# EAGLE schematic dengenver4.0 (EAGLE 9.6.2)
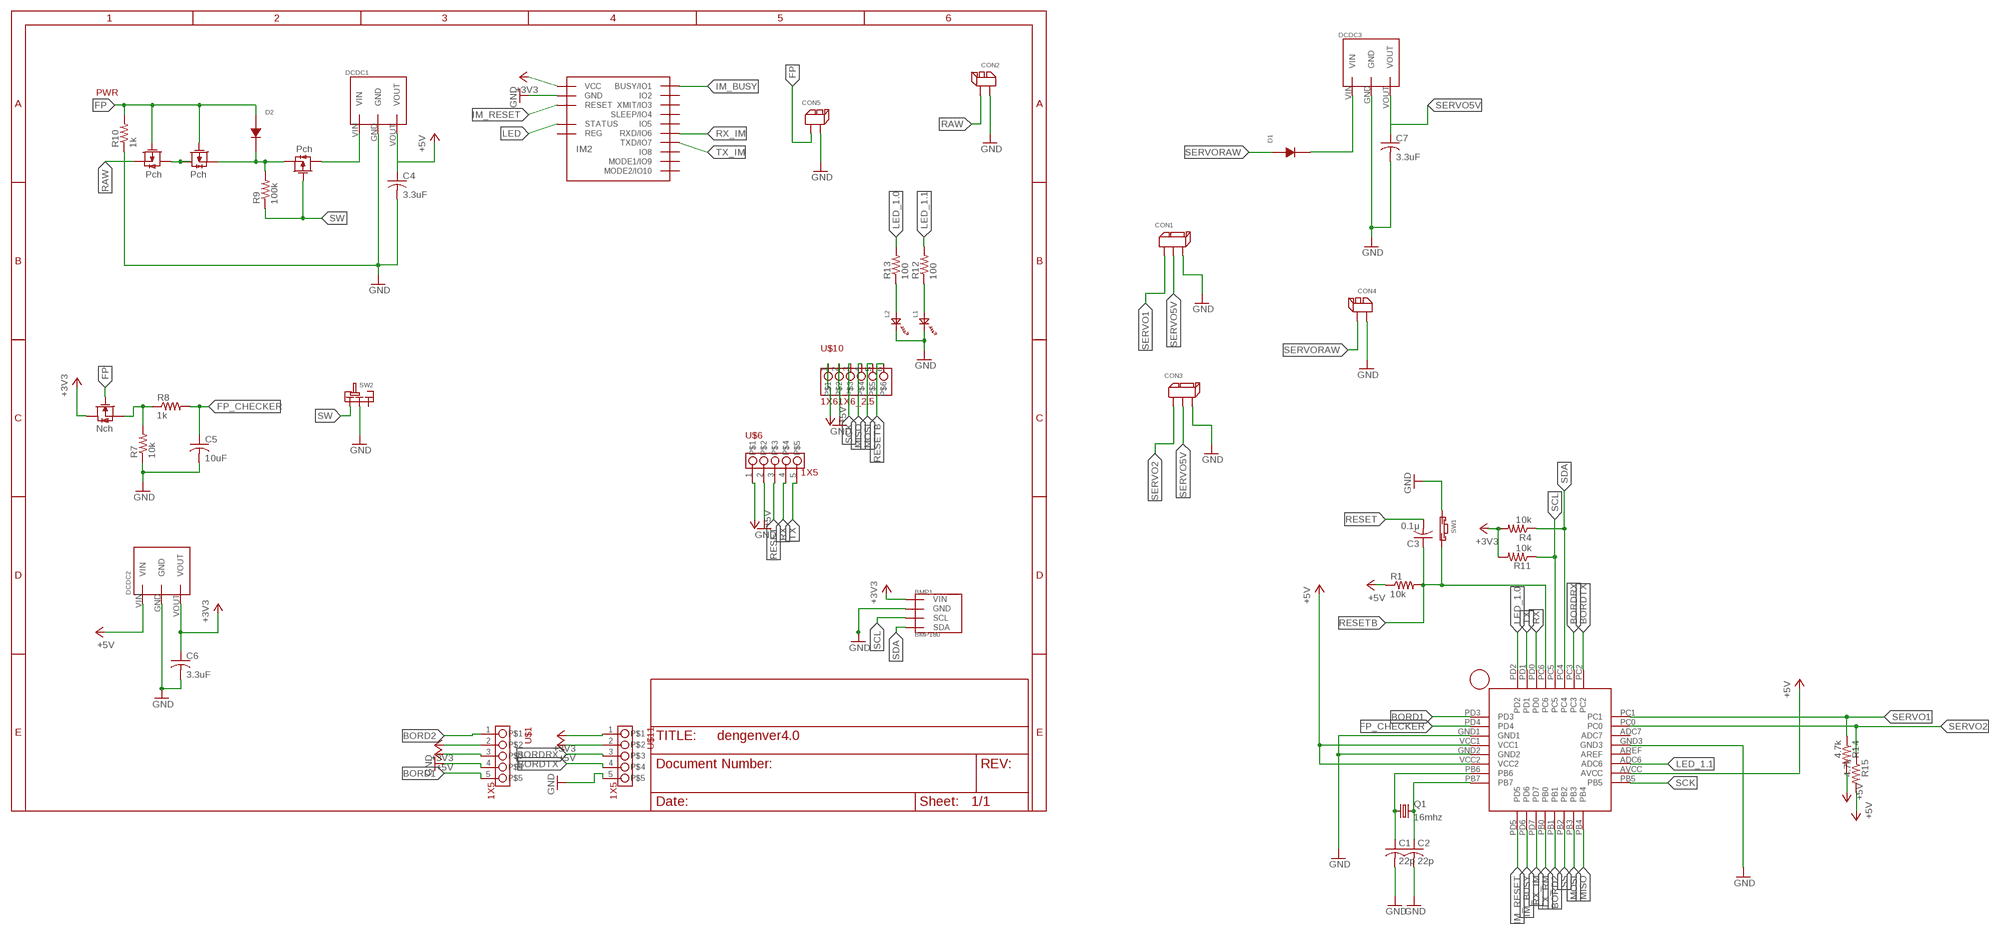
[diagram p0: schematic, sheet 1]

## Parts
BMP1  BMP180  [GY-68]
C1  22p  C-USC1608  [C1608]
C2  22p  C-USC1608  [C1608]
C3  0.1μ  C-USC1608  [C1608]
C4  3.3uF  C-USC1608  [C1608]
C5  10uF  C-USC1608  [C1608]
C6  3.3uF  C-USC1608  [C1608]
C7  3.3uF  C-USC0603  [C0603]
CON1  3PIN  [3PIN]
CON2  2PIN  [2PIN]
CON3  3PIN  [3PIN]
CON4  2PIN  [2PIN]
CON5  2PIN  [2PIN]
D1  1W4148W  [SOD-123]
D2  1W4148W  [SOD-123]
DCDC1  5V1A_M78AR05-1  [5V1A_M78AR05-1]
DCDC2  3.3V1A_M78AR033-1  [3.3V1A_M78AR033-1]
DCDC3  5V1A_M78AR05-1  [5V1A_M78AR05-1]
IM2  IM920_IM920C  [IM920_IM920C]
L1  OSXX1608C1A  [OSXX1608C1A]
L2  OSXX1608C1A  [OSXX1608C1A]
Q1  16mhz  CRYSTALHC49UP  [HC49UP]
R1  10k  R-US_R0603  [R0603]
R4  10k  R-US_R0603  [R0603]
R7  10k  R-US_R0603  [R0603]
R8  1k  R-US_R0603  [R0603]
R9  100k  R-US_R0603  [R0603]
R10  1k  R-US_R0603  [R0603]
R11  10k  R-US_R0603  [R0603]
R12  100  R-US_R0603  [R0603]
R13  100  R-US_R0603  [R0603]
R14  4.7k  R-US_R0603  [R0603]
R15  4.7k  R-US_R0603  [R0603]
SW1  TVAF06-A020B-R  [TVAF06-A020B-R]
SW2  SRIDE_SWITCH  [SRIDE_SWITCH]
U$1  1X5  [HDRVR5W64P254_1X5_1310X250X865B]
U$2  2SJ681-PCH  [2SJ681]
U$3  2SK4017-NCH  [2SK4017]
U$4  2SJ681-PCH  [2SJ681]
U$5  2SJ681-PCH  [2SJ681]
U$6  1X5  [HDRVR5W64P254_1X5_1310X250X865B]
U$8  ATMEGA328P-AU  [QFP80P900X900X120-32N]
U$10  1X61X6_2.5  [HDRVR6W64P254_1X6_1564X250X865B]
U$11  1X5  [HDRVR5W64P254_1X5_1310X250X865B]

## Nets
+3V3: BMP1.P1(VIN) C6.1 DCDC2.VOUT IM2.$P17(VCC) R4.2 R11.2 U$1.2 U$3.DRAIN U$11.1
+5V: C4.1 DCDC1.VOUT DCDC2.VIN R1.1 R14.2 R15.2 U$1.3 U$6.1 U$8.AVCC U$8.VCC1 U$8.VCC2 U$10.1 U$11.2
+5V1: DCDC1.VIN U$5.DRAIN
BORD1: U$1.5 U$8.PD3
BORD2: U$1.1 U$8.PB1
BORDRX: U$8.PC3 U$11.3
BORDTX: U$8.PC2 U$11.4
FP: CON5.P$1 D2.C R10.2 U$2.GATE U$3.GATE U$4.GATE
FP1: D1.C
FP_CHECKER: C5.1 R8.2 U$8.PD4
GND: BMP1.P2(GND) C1.2 C2.2 C4.2 C5.2 C6.2 C7.2 CON1.P$3 CON2.P$1 CON3.P$3 CON4.P$1 CON5.P$2 DCDC1.GND DCDC2.GND DCDC3.GND IM2.$P18(GND) L1.CT L2.CT R7.1 R10.1 SW1.P$1 SW2.LR U$1.4 U$6.2 U$8.GND1 U$8.GND2 U$8.GND3 U$10.2 U$11.5
IM_BUSY: IM2.$P1(BUSY/IO1) U$8.PD6
IM_RESET: IM2.$P19(RESET) U$8.PD5
LED: IM2.$P15(STATUS)
LED_1.0: R13.2 U$8.PD2
LED_1.1: R12.2 U$8.ADC6
MISO: U$8.PB4 U$10.4
MOSI: U$8.PB3 U$10.5
N$2: U$2.DRAIN U$4.DRAIN
N$3: D2.A R9.2 U$4.SOURCE U$5.SOURCE
N$9: L2.AN R13.1
N$10: L1.AN R12.1
N$12: C1.1 Q1.1 U$8.PB6
N$13: C2.1 Q1.2 U$8.PB7
N$14: R7.2 R8.1 U$3.SOURCE
RAW: CON2.P$2 U$2.SOURCE
RESET: C3.2 U$6.3
RESETB: C3.1 R1.2 SW1.P$2 U$8.PC6 U$10.6
RX: U$6.4 U$8.PD0
RX_IM: IM2.$P6(RXD/IO6) U$8.PD7
SCK: U$8.PB5 U$10.3
SCL: BMP1.P3(SCL) R11.1 U$8.PC5
SDA: BMP1.P4(SDA) R4.1 U$8.PC4
SERVO1: CON1.P$1 R14.1 U$8.PC1
SERVO2: CON3.P$1 R15.1 U$8.PC0
SERVO5V: C7.1 CON1.P$2 CON3.P$2 DCDC3.VOUT
SERVORAW: CON4.P$2 D1.A DCDC3.VIN
SS: U$8.PB2
SW: R9.1 SW2.L U$5.GATE
TX: U$6.5 U$8.PD1
TX_IM: IM2.$P7(TXD/IO7)
TX_RM: U$8.PB0
Unconnected: IM2.$P2(IO2) IM2.$P3(XMIT/IO3) IM2.$P4(SLEEP/IO4) IM2.$P5(IO5) IM2.$P8(IO8) IM2.$P9(MODE1/IO9) IM2.$P10(MODE2/IO10) IM2.$P16(REG) SW2.R U$8.ADC7 U$8.AREF

## Notes on the sheet
- PWR

## Library data of the parts
BMP1 = BMP180:BMP180
C1-C7 = rcl:C-US: CAPACITOR, American symbol; SPICEPREFIX: C
CON1 CON3 = XR Connector:3PIN
CON2 CON4 CON5 = XR Connector:2PIN
D1 D2 = ChipDiodes:1W4148W
DCDC1 DCDC3 = DC-DC:5V1A_M78AR05-1
DCDC2 = DC-DC:3.3V1A_M78AR033-1
IM2 = CANSAT12th:IM920_IM920C
L1 L2 = Chip LED:OSXX1608C1A
Q1 = crystal:CRYSTAL: CRYSTAL; OC_FARNELL: unknown; OC_NEWARK: unknown
R1 R4 R7-R15 = rcl:R-US_: RESISTOR, American symbol; SPICEPREFIX: R
SW1 = Tact switch:TVAF06-A020B-R
SW2 = Sride Switch:SRIDE_SWITCH
U$1 U$6 U$11 = pin_socket:1X5
U$2 U$4 U$5 = mosfet:2SJ681-PCH
U$3 = mosfet:2SK4017-NCH
U$8 = ATMEGA328P-AU:ATMEGA328P-AU
U$10 = pin_socket:1X6